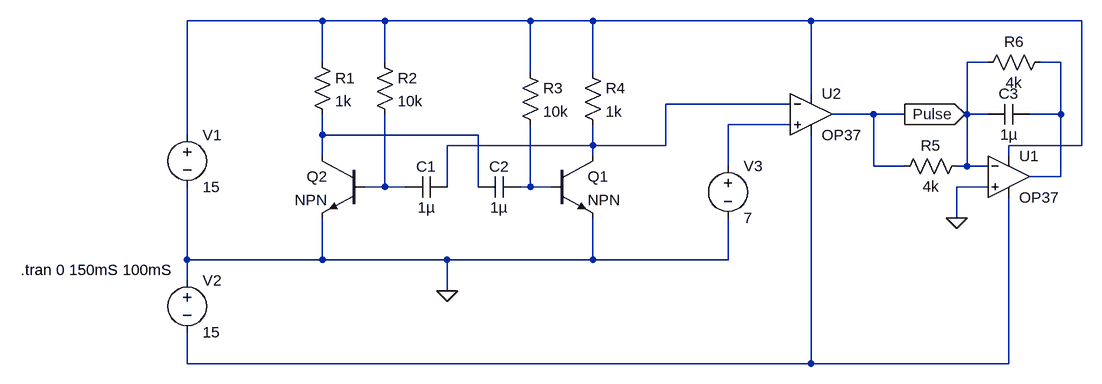
[diagram p0: schematic LFO.asc]
LFO.asc, the LTspice schematic file:
Version 4
SHEET 1 1140 680
WIRE -32 -48 -240 -48
WIRE 64 -48 -32 -48
WIRE 288 -48 64 -48
WIRE 384 -48 288 -48
WIRE 720 -48 384 -48
WIRE 1136 -48 720 -48
WIRE -32 16 -32 -48
WIRE 64 16 64 -48
WIRE 992 16 960 16
WIRE 1104 16 1072 16
WIRE 288 32 288 -48
WIRE 384 32 384 -48
WIRE 720 64 720 -48
WIRE 688 80 496 80
WIRE 816 96 752 96
WIRE 864 96 816 96
WIRE 960 96 960 16
WIRE 992 96 960 96
WIRE 1104 96 1104 16
WIRE 1104 96 1056 96
WIRE 688 112 592 112
WIRE -240 128 -240 -48
WIRE -32 128 -32 96
WIRE 208 128 -32 128
WIRE 384 144 384 112
WIRE 384 144 160 144
WIRE 496 144 496 80
WIRE 496 144 384 144
WIRE 1136 144 1136 -48
WIRE 1136 144 1024 144
WIRE -32 160 -32 128
WIRE 384 160 384 144
WIRE 1024 160 1024 144
WIRE 592 176 592 112
WIRE 816 176 816 96
WIRE 864 176 816 176
WIRE 960 176 960 96
WIRE 960 176 944 176
WIRE 992 176 960 176
WIRE 1104 192 1104 96
WIRE 1104 192 1056 192
WIRE 64 208 64 96
WIRE 64 208 32 208
WIRE 96 208 64 208
WIRE 160 208 160 144
WIRE 208 208 208 128
WIRE 288 208 288 112
WIRE 288 208 272 208
WIRE 320 208 288 208
WIRE 992 208 944 208
WIRE 944 256 944 208
WIRE -240 320 -240 208
WIRE -32 320 -32 256
WIRE -32 320 -240 320
WIRE 160 320 -32 320
WIRE 384 320 384 256
WIRE 384 320 160 320
WIRE 592 320 592 256
WIRE 592 320 384 320
WIRE -240 352 -240 320
WIRE 160 368 160 320
WIRE -240 480 -240 432
WIRE 720 480 720 128
WIRE 720 480 -240 480
WIRE 1024 480 1024 224
WIRE 1024 480 720 480
FLAG 160 368 0
FLAG 864 96 Pulse
IOPIN 864 96 Out
FLAG 944 256 0
SYMBOL npn 320 160 R0
SYMATTR InstName Q1
SYMBOL npn 32 160 M0
SYMATTR InstName Q2
SYMBOL res -48 0 R0
SYMATTR InstName R1
SYMATTR Value 1k
SYMBOL res 48 0 R0
SYMATTR InstName R2
SYMATTR Value 10k
SYMBOL res 272 16 R0
SYMATTR InstName R3
SYMATTR Value 10k
SYMBOL res 368 16 R0
SYMATTR InstName R4
SYMATTR Value 1k
SYMBOL cap 160 192 R90
WINDOW 0 0 32 VBottom 2
WINDOW 3 32 32 VTop 2
SYMATTR InstName C1
SYMATTR Value 1µ
SYMBOL cap 272 192 R90
WINDOW 0 0 32 VBottom 2
WINDOW 3 32 32 VTop 2
SYMATTR InstName C2
SYMATTR Value 1µ
SYMBOL voltage -240 112 R0
WINDOW 123 0 0 Left 2
WINDOW 39 0 0 Left 2
SYMATTR InstName V1
SYMATTR Value 15
SYMBOL voltage -240 336 R0
WINDOW 123 0 0 Left 2
WINDOW 39 0 0 Left 2
SYMATTR InstName V2
SYMATTR Value 15
SYMBOL voltage 592 160 R0
WINDOW 123 0 0 Left 2
WINDOW 39 0 0 Left 2
SYMATTR InstName V3
SYMATTR Value 7
SYMBOL Opamps\\OP37 720 32 R0
SYMATTR InstName U2
SYMBOL Opamps\\OP37 1024 128 R0
SYMATTR InstName U1
SYMBOL res 960 160 R90
WINDOW 0 0 56 VBottom 2
WINDOW 3 32 56 VTop 2
SYMATTR InstName R5
SYMATTR Value 4k
SYMBOL cap 1056 80 R90
WINDOW 0 0 32 VBottom 2
WINDOW 3 32 32 VTop 2
SYMATTR InstName C3
SYMATTR Value 1µ
SYMBOL res 1088 0 R90
WINDOW 0 0 56 VBottom 2
WINDOW 3 32 56 VTop 2
SYMATTR InstName R6
SYMATTR Value 4k
TEXT -496 336 Left 2 !.tran 0 150mS 100mS

The netlist it stands for:
* LFO.asc
Q1 N004 N008 0 0 NPN
Q2 N006 N007 0 0 NPN
R1 N001 N006 1k
R2 N001 N007 10k
R3 N001 N008 10k
R4 N001 N004 1k
C1 N004 N007 1µ
C2 N008 N006 1µ
V1 N001 0 15
V2 0 N009 15
V3 N005 0 7
XU2 N005 N004 N001 N009 Pulse LT1037  ; OP37, pins In+ In- V+ V- OUT
XU1 0 N002 N001 N009 N003 LT1037  ; OP37, pins In+ In- V+ V- OUT
R5 N002 Pulse 4k
C3 N003 N002 1µ
R6 N003 N002 4k
.model NPN NPN
.model PNP PNP
.lib standard.bjt
.tran 0 150mS 100mS
.lib LTC.lib
.backanno
.end